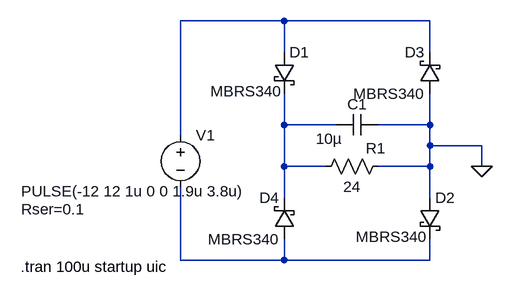
[diagram p0: schematic ps_startup.asc]
ps_startup.asc, the LTspice schematic file:
Version 4
SHEET 1 880 680
WIRE 240 -16 80 -16
WIRE 464 -16 240 -16
WIRE 240 32 240 -16
WIRE 464 32 464 -16
WIRE 240 144 240 96
WIRE 320 144 240 144
WIRE 464 144 464 96
WIRE 464 144 384 144
WIRE 80 160 80 -16
WIRE 464 176 464 144
WIRE 544 176 464 176
WIRE 240 208 240 144
WIRE 304 208 240 208
WIRE 464 208 464 176
WIRE 464 208 384 208
WIRE 544 208 544 176
WIRE 240 256 240 208
WIRE 464 256 464 208
WIRE 80 352 80 240
WIRE 240 352 240 320
WIRE 240 352 80 352
WIRE 464 352 464 320
WIRE 464 352 240 352
FLAG 544 208 0
SYMBOL voltage 80 144 R0
WINDOW 3 -245 102 Left 2
WINDOW 123 0 0 Left 2
WINDOW 39 -245 130 Left 2
SYMATTR InstName V1
SYMATTR Value PULSE(-12 12 1u 0 0 1.9u 3.8u)
SYMATTR SpiceLine Rser=0.1
SYMBOL schottky 224 32 R0
WINDOW 3 -98 60 Left 2
SYMATTR InstName D1
SYMATTR Value MBRS340
SYMATTR Description Diode
SYMATTR Type diode
SYMBOL cap 384 128 R90
WINDOW 0 0 32 VBottom 2
WINDOW 3 22 75 VTop 2
SYMATTR InstName C1
SYMATTR Value 10µ
SYMBOL res 400 192 R90
WINDOW 0 4 19 VBottom 2
WINDOW 3 32 56 VTop 2
SYMATTR InstName R1
SYMATTR Value 24
SYMBOL schottky 448 256 R0
WINDOW 3 -98 60 Left 2
SYMATTR InstName D2
SYMATTR Value MBRS340
SYMATTR Description Diode
SYMATTR Type diode
SYMBOL schottky 480 96 R180
WINDOW 0 24 64 Left 2
WINDOW 3 24 0 Left 2
SYMATTR InstName D3
SYMATTR Value MBRS340
SYMATTR Description Diode
SYMATTR Type diode
SYMBOL schottky 256 320 R180
WINDOW 0 24 64 Left 2
WINDOW 3 24 0 Left 2
SYMATTR InstName D4
SYMATTR Value MBRS340
SYMATTR Description Diode
SYMATTR Type diode
TEXT -166 362 Left 2 !.tran 100u startup uic

The netlist it stands for:
* ps_startup.asc
V1 N001 N003 PULSE(-12 12 1u 0 0 1.9u 3.8u) Rser=0.1
D1 N001 N002 MBRS340
C1 0 N002 10µ
R1 0 N002 24
D2 0 N003 MBRS340
D3 0 N001 MBRS340
D4 N003 N002 MBRS340
.model D D
.lib standard.dio
.tran 100u startup uic
.backanno
.end